# EAGLE design robo1 (EAGLE 9.0.1)
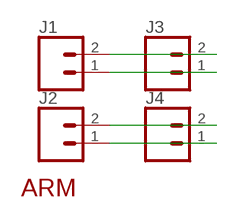
[diagram p0: schematic, sheet 1]

## Parts
J1  CONN_02LOCK  [1X02_LOCK]
J2  CONN_02LOCK  [1X02_LOCK]
J3  CONN_02LOCK  [1X02_LOCK]
J4  CONN_02LOCK  [1X02_LOCK]
U$1  ARMROBO1  [ROBOT1]

## Nets
V1: J1.1 J3.1
V2: J1.2 J3.2
V3: J2.1 J4.1
V4: J2.2 J4.2

## Library data of the parts
J1-J4 = SparkFun-Connectors:CONN_02: Multi connection point. Often used as Generic Header-pin footprint for 0.1 inch spaced/style header connections On any of the 0.1 inch spaced packages, you can populate with these: Break Away Headers - Straight <https://www.sparkfun.com/products/116> (PRT-00116) Break Away Male Headers - Right Angle <https://www.sparkfun.com/products/553> (PRT-00553) Female Headers <https://www.sparkfun.com/products/115> (PRT-00115) Break Away Headers - Machine Pin <https://www.sparkfun.com/products/117> (PRT-00117) Break Away Female Headers - Swiss Machine Pin <https://www.sparkfun.com/products/743> (PRT-00743) For SCREWTERMINALS and SPRING TERMINALS visit here: Screw Terimnals on SparkFun.com <https://www.sparkfun.com/search/results?term=Screw+Terminals> (5mm/3.5mm/2.54mm spacing) This device is also useful as a general connection point to wire up your design to another part of your project. Our various solder wires solder well into these plated through hole pads. Hook-Up Wire - Assortment (Stranded, 22 AWG) <https://www.sparkfun.com/products/11375> (PRT-11375) Hook-Up Wire - Assortment (Solid Core, 22 AWG) <https://www.sparkfun.com/products/11367> (PRT-11367) View the entire wire category on our website here <https://www.sparkfun.com/categories/141> Special notes: Molex polarized connector foot print use with: PRT-08233 with associated crimp pins and housings. 2.54_SCREWTERM for use with PRT-10571. 3.5mm Screw Terminal footprints for PRT-08084 5mm Screw Terminal footprints for use with PRT-08432
U$1 = arms:ARM

## Board
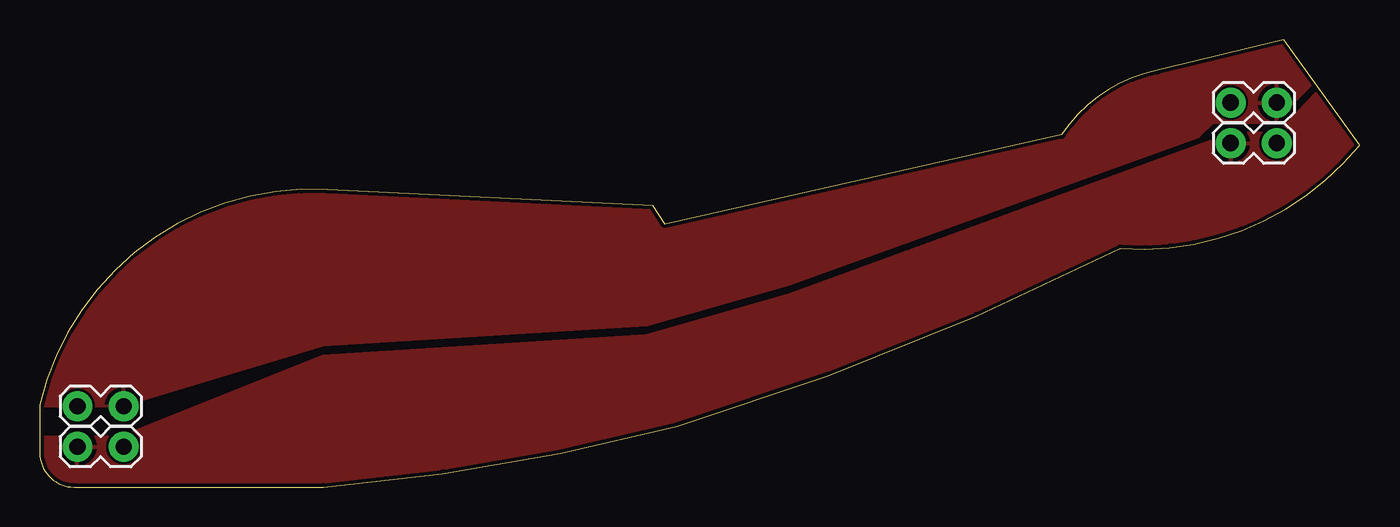
[diagram p1: board, top side]
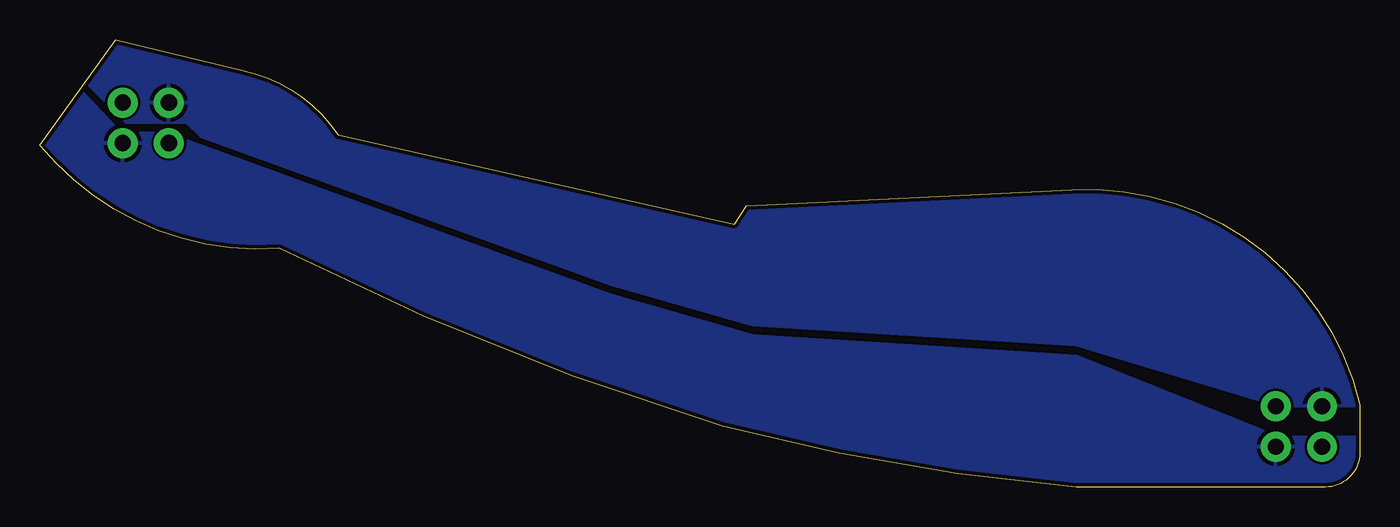
[diagram p2: board, bottom side, seen from below]

Size 82.86 x 28.07 mm. Coordinates in mm from the lower left corner, seen from the top.
Outline: 38.48,17.65 18.05,18.66 arc80 0,5.16 0,2.15 arc90 2.15,0 17.78,0 arc10 40.01,3.81 arc10 67.82,14.99 arc55 82.86,21.46 78.11,28.07 70.16,26.15 arc45 64.14,22.1 39.24,16.51 38.48,17.65
Copper layers (1*16): Top 0.035mm / dielectric 1.5mm / Bottom 0.035mm
Design rules "default *": minimum track width 6mil, minimum drill 0.35mm, track to track 6mil, track to pad 6mil, pad to pad 6mil, via to via 6mil, smd to smd 6mil, copper to edge 10mil, drill to drill 6mil, minimum pad ring 10mil, minimum via ring 8mil, stop-mask expansion 4mil, vias tented up to drill 0mil, thermal gap 10mil

### Footprints (pad centres in the part's own frame; a part is rotated, then mirrored left to right if it is on the bottom)
1X02_LOCK = drill 1.016 pad 1.88: 1 -0.178,0; 2 2.718,0

### Placement (x,y rotation side)
J1  74.93,21.59 0 top
J2  74.93,24.13 0 top
J3  2.54,2.54 0 top
J4  2.54,5.08 0 top
U$1  17.78,1.27 0 top

### Tracks (layer width: path | path; a pad name or v marks a point on that pad's centre or on a via)
V1
  pour Top: 0,0 0,3.17 5.08,3.17 17.78,8.26 38.1,9.53 46.99,12.06 74.93,22.23 77.72,22.23 82.55,27.3 82.55,0
V2
  pour Bottom: 0,0 0,3.17 5.08,3.17 17.78,8.26 38.1,9.53 46.99,12.06 74.93,22.23 77.72,22.23 82.55,27.3 82.55,0
V3
  pour Bottom: 0,52.07 0,5.08 5.08,5.08 17.78,8.89 38.1,10.16 46.99,12.7 72.77,21.97 73.66,22.86 77.47,22.86 82.55,27.94 82.55,52.07
V4
  pour Top: 0,52.07 0,5.08 5.08,5.08 17.78,8.89 38.1,10.16 46.99,12.7 72.77,21.97 73.66,22.86 77.47,22.86 82.55,27.94 82.55,52.07

### Text on the board
tStop: by / @securelyfitz / git.io/sao-arms